# EAGLE design OpenProg-18F2550-2 (EAGLE 7.2.0)
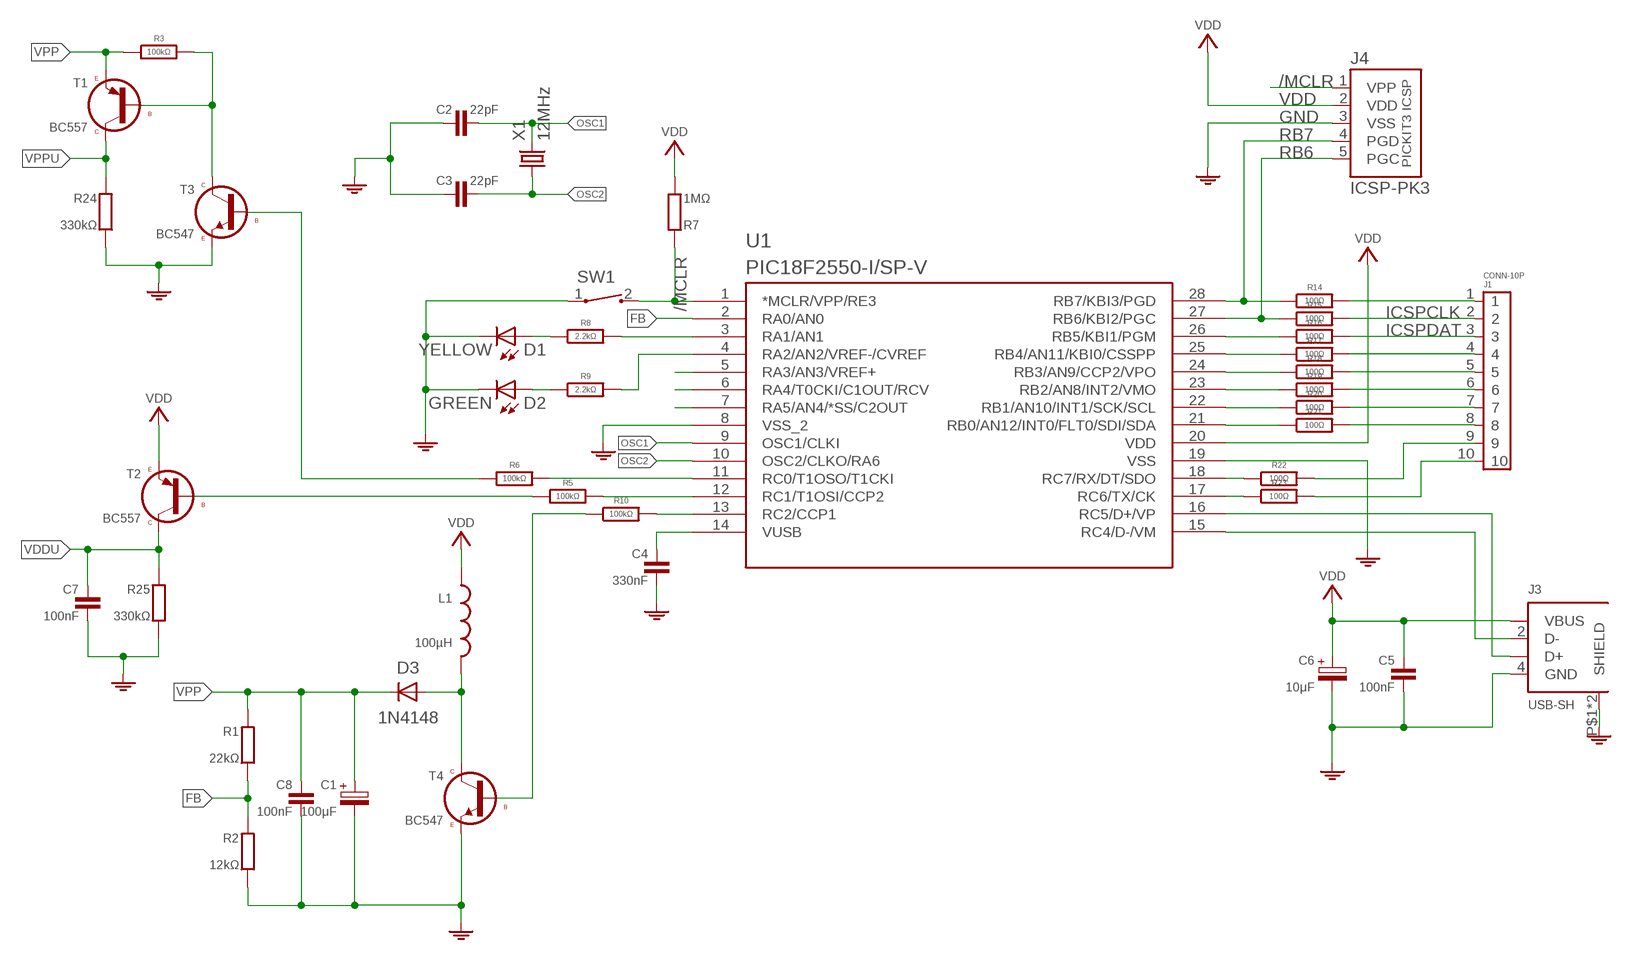
[diagram p0: schematic, sheet 1]

## Parts
C1  100μF  CPOLE5-5  [E5-5]
C2  22pF  C-H025-015X024  [C025-015X024]
C3  22pF  C-H025-015X024  [C025-015X024]
C4  330nF  C050-030X075  [C050-030X075]
C5  100nF  C050-025X075  [C050-025X075]
C6  10μF  CPOLE5-5  [E5-5]
C7  100nF  C050-025X075  [C050-025X075]
C8  100nF  C050-025X075  [C050-025X075]
D1  YELLOW  LED-H-3MM  [LED3MM]
D2  GREEN  LED-H-3MM  [LED3MM]
D3  1N4148  1N4148-HDO34-7  [DO34-7]
J1  CONN-10P  [CONN-10P]
J3  USB-SH  [USB-B-PRINT]
J4  ICSP-PK3  PICKIT3-ICSP-PK3  [PIC-PK3]
L1  100µH  L02/10  [L-03/10V]
R1  22kΩ  R0204/10-V  [0204/10-V]
R2  12kΩ  R0204/10-V  [0204/10-V]
R3  100kΩ  R-H0204/10-V  [0204/10-V]
R5  100kΩ  R-H0204/10  [0204/10]
R6  100kΩ  R-H0204/10  [0204/10]
R7  1MΩ  R0204/10-V  [0204/10-V]
R8  2.2kΩ  R-H0204/10  [0204/10]
R9  2.2kΩ  R-H0204/10  [0204/10]
R10  100kΩ  R-H0204/10  [0204/10]
R14  100Ω  R-H0204/10  [0204/10]
R15  100Ω  R-H0204/10  [0204/10]
R16  100Ω  R-H0204/10  [0204/10]
R17  100Ω  R-H0204/10  [0204/10]
R18  100Ω  R-H0204/10  [0204/10]
R19  100Ω  R-H0204/10  [0204/10]
R20  100Ω  R-H0204/10  [0204/10]
R21  100Ω  R-H0204/10  [0204/10]
R22  100Ω  R-H0204/10  [0204/10]
R23  100Ω  R-H0204/10  [0204/10]
R24  330kΩ  R0204/10-V  [0204/10-V]
R25  330kΩ  R0204/10-V  [0204/10-V]
SW1  PUSHBUTTON-P1T  [PB-1P1T]
T1  BC557  BC557CBE-A  [TO92-CBE-A]
T2  BC557  BC557CBE-A  [TO92-CBE-A]
T3  BC547  BC547-A  [TO92-CBE-A]
T4  BC547  BC547-A  [TO92-CBE-A]
U1  PIC18F2550-I/SP-V  [DIL28-3/V]
X1  12MHz  CRYSTALHC49  [HC49]

## Nets
/MCLR: J4.1(VPP) R7.1 SW1.2 U1.1(*MCLR/VPP/RE3)
FB: R1.2 R2.1 U1.2(RA0/AN0)
GND: C1.- C2.1 C3.1 C4.2 C5.2 C6.- C7.2 C8.2 D1.K(C) D2.K(C) J3.4(GND) J3.P$1(SHIELD) J3.P$2(SHIELD) J4.3(VSS) R2.2 R24.2 R25.2 SW1.1 T3.3(E) T4.3(E) U1.8(VSS_2) U1.19(VSS)
ICSPCLK: J1.2 R15.2
ICSPDAT: J1.3 R16.2
N$2: R10.1 T4.2(B)
N$3: U1.5(RA3/AN3/VREF+)
N$4: U1.6(RA4/T0CKI/C1OUT/RCV)
N$5: D3.A L1.2 T4.1(C)
N$6: U1.7(RA5/AN4/*SS/C2OUT)
N$7: R6.1 T3.2(B)
N$11: R3.2 T1.2(B) T3.1(C)
N$12: R5.1 T2.2(B)
N$16: R16.1 U1.26(RB5/KBI1/PGM)
N$17: R17.1 U1.25(RB4/AN11/KBI0/CSSPP)
N$18: R18.1 U1.24(RB3/AN9/CCP2/VPO)
N$19: R19.1 U1.23(RB2/AN8/INT2/VMO)
N$20: R20.1 U1.22(RB1/AN10/INT1/SCK/SCL)
N$21: R21.1 U1.21(RB0/AN12/INT0/FLT0/SDI/SDA)
N$22: J1.1 R14.2
N$25: J1.4 R17.2
N$26: J1.5 R18.2
N$27: J1.6 R19.2
N$28: J1.7 R20.2
N$29: J1.8 R21.2
N$30: R22.1 U1.18(RC7/RX/DT/SDO)
N$31: R23.1 U1.17(RC6/TX/CK)
N$32: J1.9 R22.2
N$33: J1.10 R23.2
N$34: J3.3(D+) U1.16(RC5/D+/VP)
N$35: J3.2(D-) U1.15(RC4/D-/VM)
N$36: C4.1 U1.14(VUSB)
N$39: D1.A R8.1
N$40: D2.A R9.1
OSC1: C2.2 U1.9(OSC1/CLKI) X1.2
OSC2: C3.2 U1.10(OSC2/CLKO/RA6) X1.1
RA1: R8.2 U1.3(RA1/AN1)
RA2: R9.2 U1.4(RA2/AN2/VREF-/CVREF)
RB6: J4.5(PGC) R15.1 U1.27(RB6/KBI2/PGC)
RB7: J4.4(PGD) R14.1 U1.28(RB7/KBI3/PGD)
RC0: R6.2 U1.11(RC0/T1OSO/T1CKI)
RC1: R5.2 U1.12(RC1/T1OSI/CCP2)
RC2: R10.2 U1.13(RC2/CCP1)
VDD: C5.1 C6.+ J3.1(VBUS) J4.2(VDD) L1.1 R7.2 T2.3(E) U1.20(VDD)
VDDU: C7.1 R25.1 T2.1(C)
VPP: C1.+ C8.1 D3.C R1.1 R3.1 T1.3(E)
VPPU: R24.1 T1.1(C)

## Library data of the parts
C1 C6 = c:CPOL: POLARIZED CAPACITOR, European symbol
C2 C3 = c:C-H
C4 C5 C7 C8 = c:C: CAPACITOR, European symbol
D1 D2 = d:LED-H
D3 = d:1N4148-H
J1 = pinconn:CONN-10P
J3 = usb:USB-SH
J4 = pinconn:PICKIT3-ICSP
L1 = l:L: Potentiometers Beckman, Copal, Piher, Spectrol, Schukat Created by librarian@cadsoft.de
R1 R2 R7 R24 R25 = r:R: RESISTOR, European symbol
R3 R5 R6 R8-R10 R14-R23 = r:R-H
SW1 = sw:PUSHBUTTON
T1 T2 = t:BC557
T3 T4 = t:BC547
U1 = mcu:PIC18F2550-I/SP
X1 = q:CRYSTAL

## Board
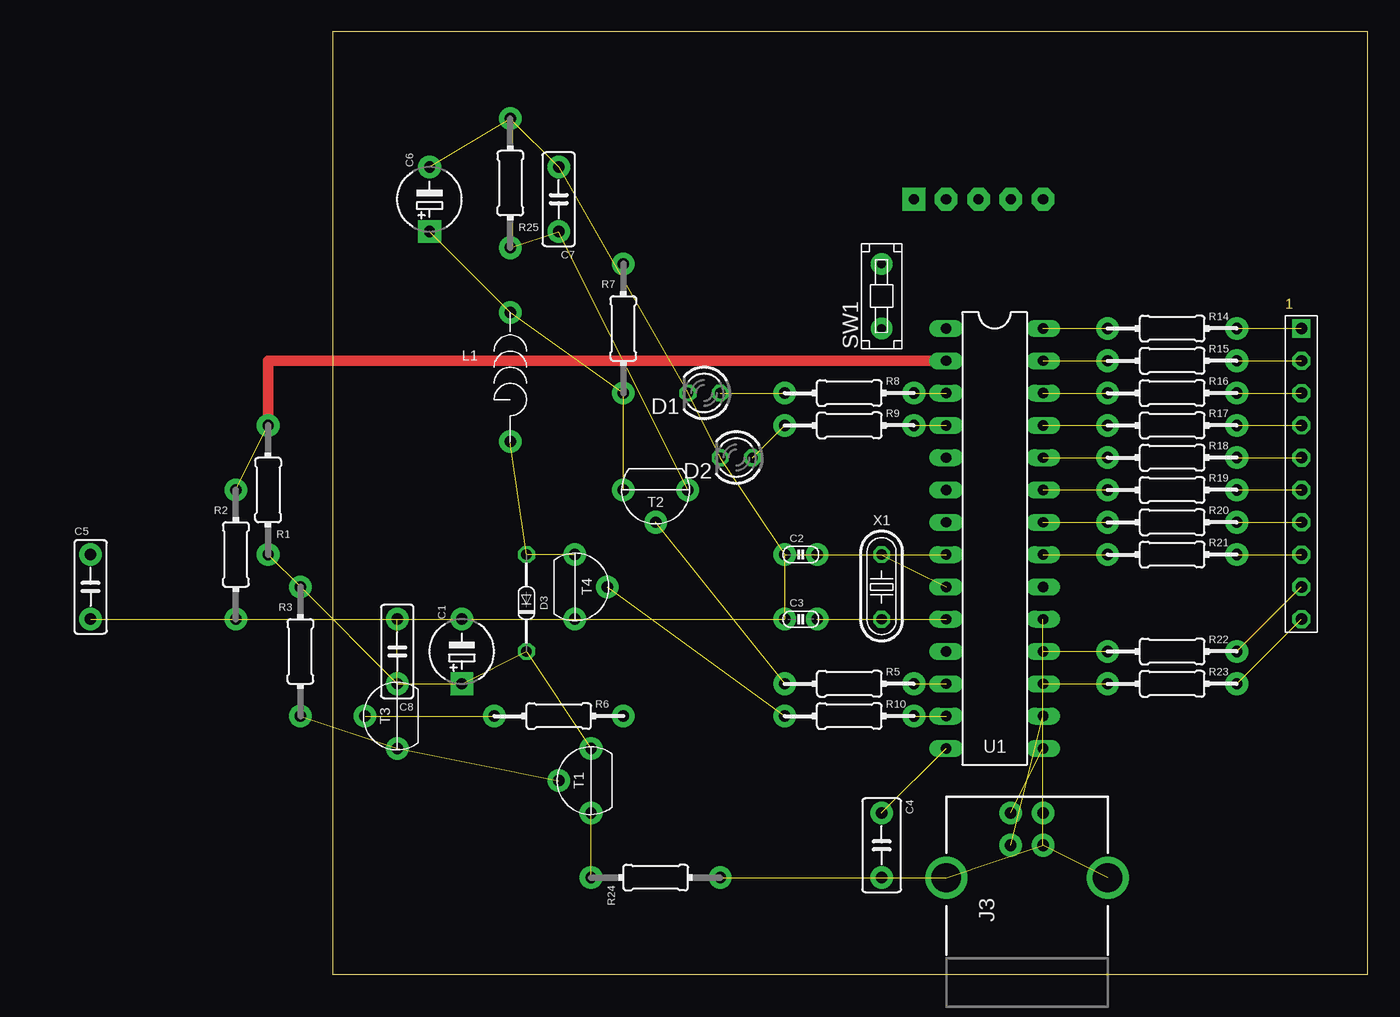
[diagram p1: board, top side]
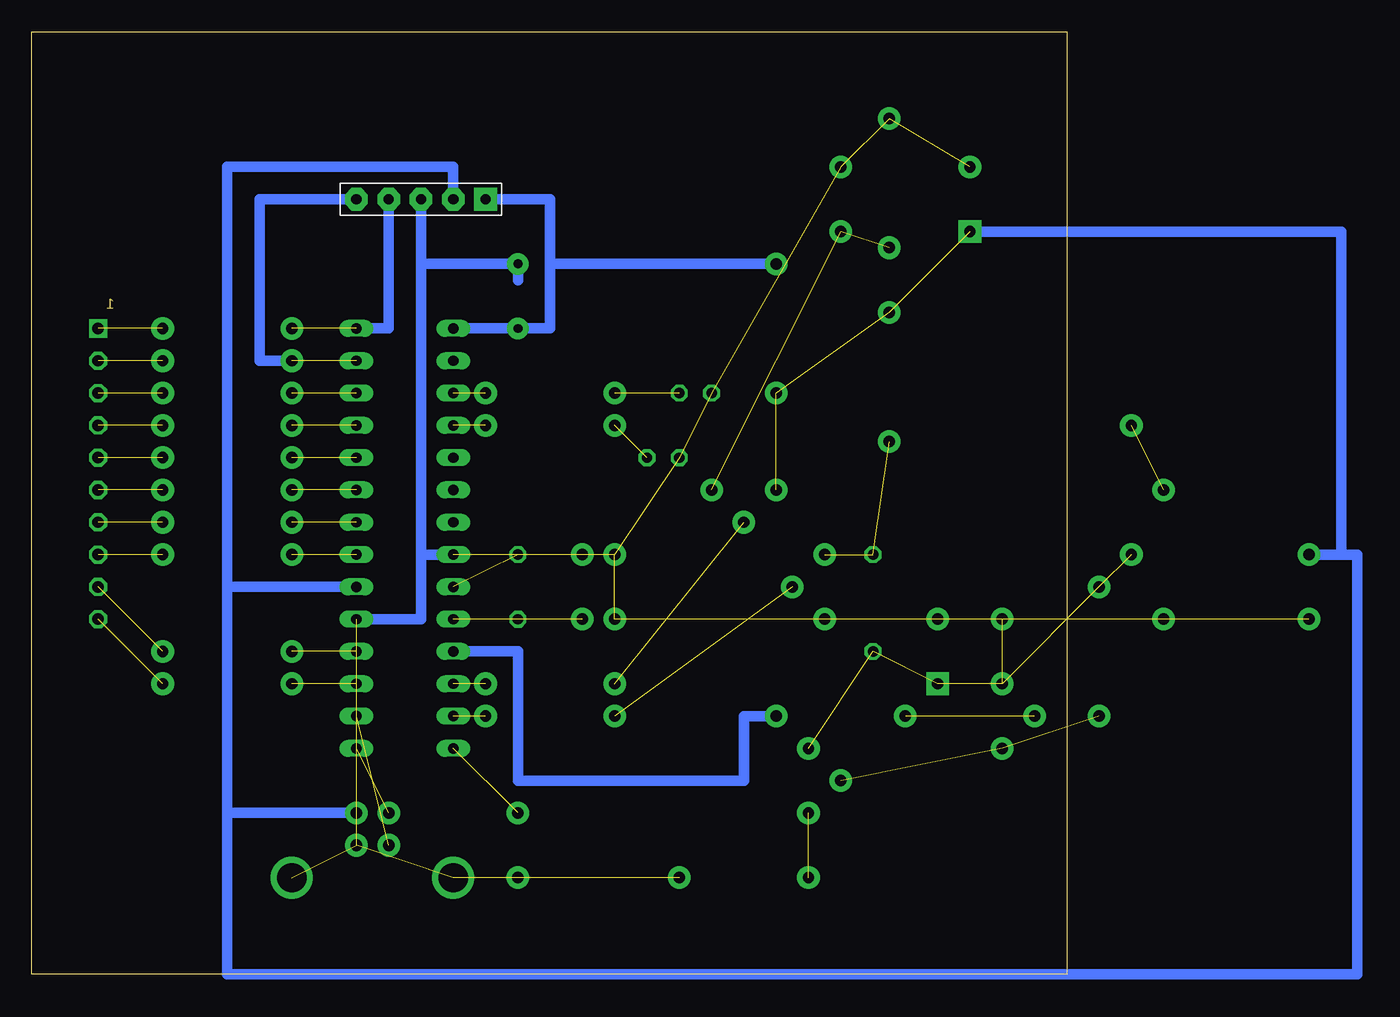
[diagram p2: board, bottom side, seen from below]

Size 81.42 x 74.13 mm. Coordinates in mm from the lower left corner, seen from the top.
Outline: 0,0 81.42,0 81.42,74.13 0,74.13 0,0
Copper layers (1*16): Top 0.035mm / dielectric 1.5mm / Bottom 0.035mm
Design rules "default": minimum track width 10mil, minimum drill 24mil, track to track 8mil, track to pad 8mil, pad to pad 8mil, via to via 8mil, smd to smd 8mil, copper to edge 40mil, drill to drill 8mil, minimum pad ring 10mil, minimum via ring 8mil, stop-mask expansion 4mil, vias tented up to drill 0mil, thermal gap 10mil

### Footprints (pad centres in the part's own frame; a part is rotated, then mirrored left to right if it is on the bottom)
E5-5 = drill 0.9 pad 1.778 square: + -2.54,0 | drill 0.9 pad 1.778: - 2.54,0
C025-015X024 = drill 0.9 pad 1.778: 1 -1.27,0; 2 1.27,0
C050-030X075 = drill 0.9 pad 1.778: 1 -2.54,0; 2 2.54,0
C050-025X075 = drill 0.9 pad 1.778: 1 2.54,0; 2 -2.54,0
LED3MM = drill 0.813 octagon: A -1.27,0; K 1.27,0
DO34-7 = drill 0.813 octagon: A -3.81,0; C 3.81,0
CONN-10P = drill 0.9 pad 1.422 square: 1 -10.16,0 | drill 0.9 pad 1.422 octagon: 2 -7.62,0; 3 -5.08,0; 4 -2.54,0; 5 0,0; 6 2.54,0; 7 5.08,0; 8 7.62,0; 9 10.16,0; 10 12.7,0
USB-B-PRINT = drill 0.914 pad 1.778: 1 0,6.35; 2 -2.54,6.35; 3 -2.54,3.81; 4 0,3.81 | drill 2.286: P$1 5.08,1.27; P$2 -7.62,1.27
PIC-PK3 = drill 0.8 pad 1.778 square: 1 -5.08,0 | drill 0.8 pad 1.778 octagon: 2 -2.54,0; 3 0,0; 4 2.54,0; 5 5.08,0
L-03/10V = drill 0.9 pad 1.778: 1 0,5.08; 2 0,-5.08
0204/10-V = drill 0.9 pad 1.778: 1 0,5.08; 2 0,-5.08
0204/10 = drill 0.9 pad 1.778: 1 -5.08,0; 2 5.08,0
PB-1P1T = drill 0.7 pad 1.676: 1 2.54,0; 2 -2.54,0
TO92-CBE-A = drill 0.9 pad 1.778: 1 0,2.54; 2 2.54,0; 3 0,-2.54
DIL28-3/V = drill 0.813 long: 1 -3.81,16.51; 2 -3.81,13.97; 3 -3.81,11.43; 4 -3.81,8.89; 5 -3.81,6.35; 6 -3.81,3.81; 7 -3.81,1.27; 8 -3.81,-1.27; 9 -3.81,-3.81; 10 -3.81,-6.35; 11 -3.81,-8.89; 12 -3.81,-11.43; 13 -3.81,-13.97; 14 -3.81,-16.51; 15 3.81,-16.51; 16 3.81,-13.97; 17 3.81,-11.43; 18 3.81,-8.89; 19 3.81,-6.35; 20 3.81,-3.81; 21 3.81,-1.27; 22 3.81,1.27; 23 3.81,3.81; 24 3.81,6.35; 25 3.81,8.89; 26 3.81,11.43; 27 3.81,13.97; 28 3.81,16.51
HC49 = drill 0.813 octagon: 1 0,-2.54; 2 0,2.54

### Placement (x,y rotation side)
C1  10.16,25.4 90 top
C2  36.83,33.02 0 top
C3  36.83,27.94 0 top
C4  43.18,10.16 270 top
C5  -19.05,30.48 90 top  (outside the outline)
C6  7.62,60.96 90 top
C7  17.78,60.96 270 top
C8  5.08,25.4 270 top
D1  29.21,45.72 180 top
D2  31.75,40.64 180 top
D3  15.24,29.21 270 top
J1  76.2,40.64 270 top
J3  55.88,6.35 0 top
J4  50.8,60.96 0 top
L1  13.97,46.99 0 top
R1  -5.08,38.1 180 top  (outside the outline)
R2  -7.62,33.02 0 top  (outside the outline)
R3  -2.54,25.4 0 top
R5  40.64,22.86 0 top
R6  17.78,20.32 0 top
R7  22.86,50.8 0 top
R8  40.64,45.72 0 top
R9  40.64,43.18 0 top
R10  40.64,20.32 0 top
R14  66.04,50.8 0 top
R15  66.04,48.26 0 top
R16  66.04,45.72 0 top
R17  66.04,43.18 0 top
R18  66.04,40.64 0 top
R19  66.04,38.1 0 top
R20  66.04,35.56 0 top
R21  66.04,33.02 0 top
R22  66.04,25.4 0 top
R23  66.04,22.86 0 top
R24  25.4,7.62 90 top
R25  13.97,62.23 180 top
SW1  43.18,53.34 90 top
T1  20.32,15.24 180 top
T2  25.4,38.1 270 top
T3  5.08,20.32 180 top
T4  19.05,30.48 0 top
U1  52.07,34.29 0 top
X1  43.18,30.48 0 top

### Tracks (layer width: path | path; a pad name or v marks a point on that pad's centre or on a via)
/MCLR
  Bottom 0.813: U1.1 SW1.2 40.64,50.8 40.64,55.88 | J4.1 40.64,60.96 40.64,55.88 | R7.1 40.64,55.88
FB  (1 unrouted)
  Top 0.813: U1.2 -5.08,48.26 R1.2
GND  (18 unrouted)
  Bottom 0.813: 50.8,55.88 50.8,33.02 | 50.8,33.02 50.8,27.94 U1.19 | U1.8 50.8,33.02 | J4.3 50.8,55.88 | 50.8,55.88 SW1.1 43.18,54.61
ICSPCLK  (1 unrouted)
ICSPDAT  (1 unrouted)
N$2  (1 unrouted)
N$5  (2 unrouted)
N$7  (1 unrouted)
N$11  (2 unrouted)
N$12  (1 unrouted)
N$16  (1 unrouted)
N$17  (1 unrouted)
N$18  (1 unrouted)
N$19  (1 unrouted)
N$20  (1 unrouted)
N$21  (1 unrouted)
N$22  (1 unrouted)
N$25  (1 unrouted)
N$26  (1 unrouted)
N$27  (1 unrouted)
N$28  (1 unrouted)
N$29  (1 unrouted)
N$30  (1 unrouted)
N$31  (1 unrouted)
N$32  (1 unrouted)
N$33  (1 unrouted)
N$34  (1 unrouted)
N$35  (1 unrouted)
N$36  (1 unrouted)
N$39  (1 unrouted)
N$40  (1 unrouted)
OSC1  (2 unrouted)
OSC2  (2 unrouted)
RA1  (1 unrouted)
RA2  (1 unrouted)
RB6  (1 unrouted)
  Bottom 0.813: J4.5 63.5,60.96 63.5,48.26 R15.1
RB7  (1 unrouted)
  Bottom 0.813: J4.4 53.34,50.8 U1.28
RC0
  Bottom 0.813: U1.11 43.18,25.4 43.18,15.24 25.4,15.24 25.4,20.32 R6.2
RC1  (1 unrouted)
RC2  (1 unrouted)
VDD  (3 unrouted)
  Bottom 0.813: 66.04,12.7 J3.1 | 66.04,12.7 66.04,0 -22.86,0 -22.86,33.02 -21.59,33.02 | -21.59,33.02 C5.1 | U1.20 66.04,30.48 | 66.04,30.48 66.04,12.7 | -21.59,33.02 -21.59,58.42 C6.+ | J4.2 48.26,63.5 66.04,63.5 66.04,30.48
VDDU  (2 unrouted)
VPP  (5 unrouted)
VPPU  (1 unrouted)